# Altium schematic sheet LCD.SchDoc
size A4; Organization: Altium Limited; Address1: L3, 12a Rodborough Rd; Address2: Frenchs Forest; Address3: NSW; Address4: Australia 2086
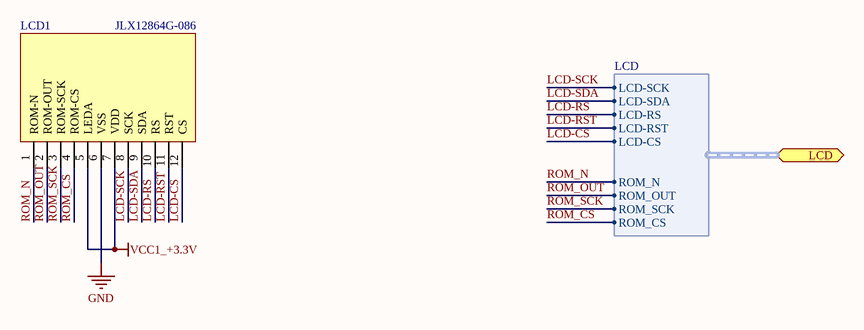
[diagram p0: LCD.SchDoc]

## Parts
LCD1  JLX12864G-086  [12864-IIC]

## Ports
LCD (harness LCD)

## Harnesses
LCD: LCD-SCK, LCD-SDA, LCD-RS, LCD-RST, LCD-CS, ROM_N, ROM_OUT, ROM_SCK, ROM_CS

## Nets
GND: LCD1.6(VSS)
VCC1_+3.3V: LCD1.5(LEDA) LCD1.7(VDD)
LCD-CS: LCD1.12(CS) ; port LCD.LCD-CS
LCD-RS: LCD1.10(RS) ; port LCD.LCD-RS
LCD-RST: LCD1.11(RST) ; port LCD.LCD-RST
LCD-SCK: LCD1.8(SCK) ; port LCD.LCD-SCK
LCD-SDA: LCD1.9(SDA) ; port LCD.LCD-SDA
ROM_CS: LCD1.4(ROM-CS) ; port LCD.ROM_CS
ROM_N: LCD1.1(ROM-N) ; port LCD.ROM_N
ROM_OUT: LCD1.2(ROM-OUT) ; port LCD.ROM_OUT
ROM_SCK: LCD1.3(ROM-SCK) ; port LCD.ROM_SCK

## Notes on the sheet
- Title
- Size:
- Date:
- A4
- Number:
- Time:
- Revision:
- Sheet
- of
- File:

## Library data of the parts
LCD1 = JLX12864G-086: LCD